# Altium project Router-UPS-9V-5V-Buck-Converter-v1.PrjPcb
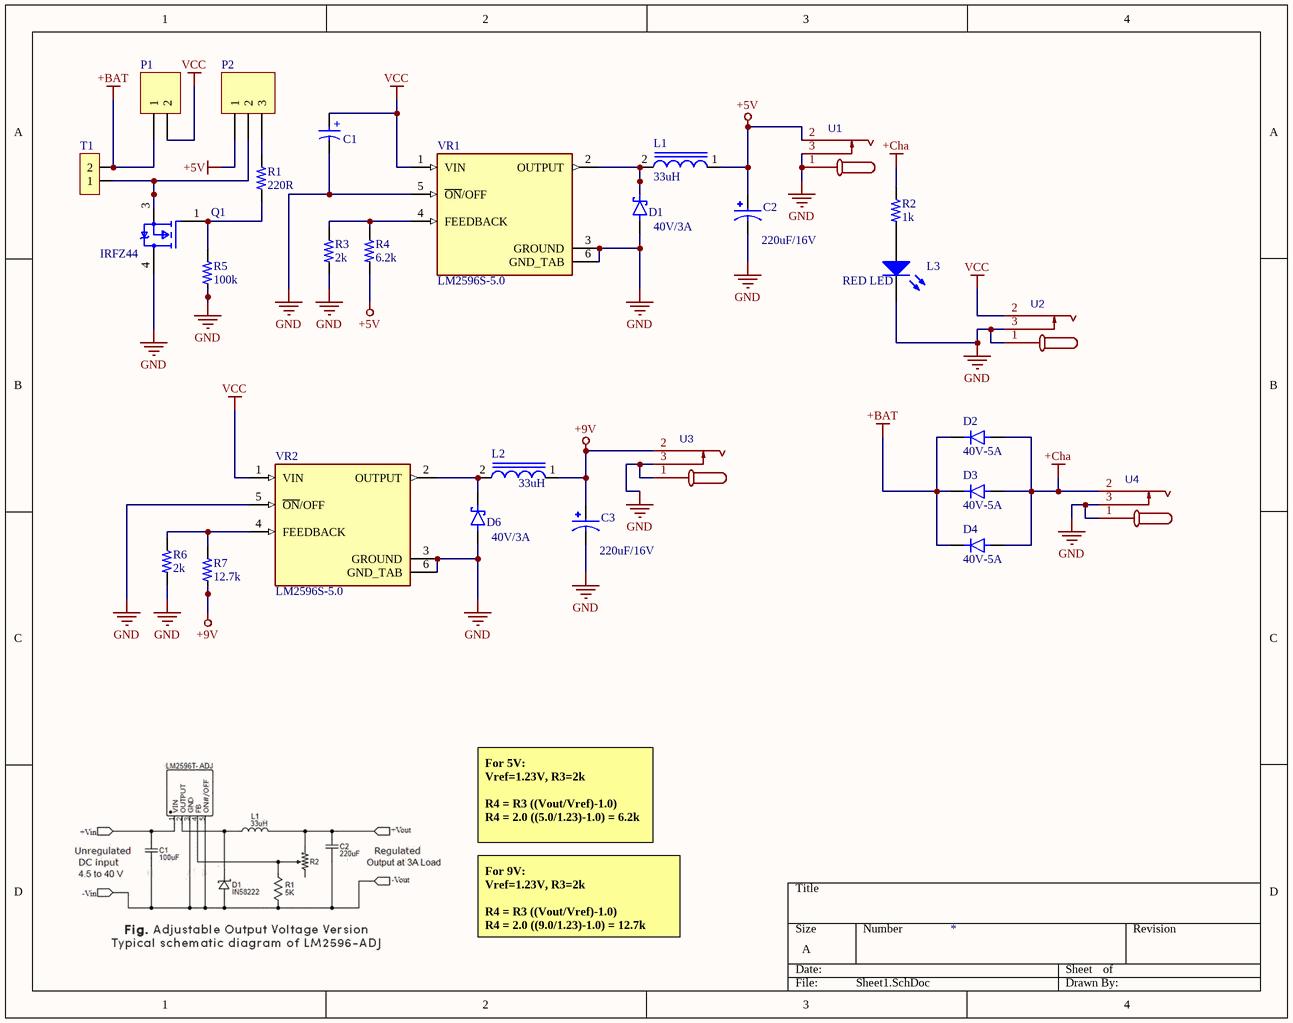
[diagram p0: Sheet1.SchDoc]
1 sheet, 28 parts. Net scope: global (net labels, ports and power ports of the same name join across sheets).
Board files: PCB1.PcbDoc, PCB-Panelize.PcbDoc

## Sheet Sheet1.SchDoc
size A; SheetNumber: 1; SheetTotal: 1

### Parts
C1  4.7µF  [WCAP-PSLP_D6.3H7.7]  (value not drawn)
C2  value 220uF/16V  [CAP-220]  (hidden comment: CAP ALUM 220uF ±20% 16V SMD)
C3  value 220uF/16V  [CAP-220]  (hidden comment: CAP ALUM 220uF ±20% 16V SMD)
D1  value 40V/3A  [SOD-123]  (hidden comment: DIODE SCHOTTKY 40V SMA(DO-214AC))
D2  value 40V-5A  [DIODE-214AC]  (hidden comment: DIODE SCHOTTKY 40V SMA)
D3  value 40V-5A  [DIODE-214AC]  (hidden comment: DIODE SCHOTTKY 40V SMA)
D4  value 40V-5A  [DIODE-214AC]  (hidden comment: DIODE SCHOTTKY 40V SMA)
D6  value 40V/3A  [SOD-123]  (hidden comment: DIODE SCHOTTKY 40V SMA(DO-214AC))
L1  value 33uH  [INDP125125X600N]  (hidden comment: FIXED IND 33uH 3A 65m SMD,12x12mm)
L2  value 33uH  [INDP125125X600N]  (hidden comment: FIXED IND 33uH 3A 65m SMD,12x12mm)
L3  value RED LED  [LED_5mm_G]  (hidden comment: LED)
P1  Header 2  [My_1X02]  (value not drawn)
P2  Header 3  [My_1X03]  (value not drawn)
Q1  value IRFZ44  [TO-263]  (hidden comment: MOSFET N-CH 60V 60A TO-263 SMD)
R1  value 220R  [RES_0805]  (hidden comment: RES 220 ±5% 125mW 0805)
R2  value 1k  [RES_0805]  (hidden comment: RES 1K 125mW 0805)
R3  value 2k  [RES_0805]  (hidden comment: RES 2K 125mW 0805)
R4  value 6.2k  [RES_0805]  (hidden comment: RES 6.2K 125mW 0805)
R5  value 100k  [RES_0805]  (hidden comment: RES 100k ±5% 125mW 0805)
R6  value 2k  [RES_0805]  (hidden comment: RES 2K 125mW 0805)
R7  value 12.7k  [RES_0805]  (hidden comment: RES 12.7K 125mW 0805)
T1  Terminal  [KF301 2Pin]  (value not drawn)
U1  DC-062A-4A-2.0  [Plugin]  (value not drawn)
U2  DC-062A-4A-2.0  [Plugin]  (value not drawn)
U3  DC-062A-4A-2.0  [Plugin]  (value not drawn)
U4  DC-062A-4A-2.0  [Plugin]  (value not drawn)
VR1  LM2596S-5.0  [TO-263-5]
VR2  LM2596S-5.0  [TO-263-5]

### Nets
+5V: C2.1 L1.1 P2.1 R4.1 U1.2
+9V: C3.1 L2.1 R7.1 U3.2
+BAT: D2.C(K) D3.C(K) D4.C(K) P1.1 T1.2
+Cha: D2.A D3.A D4.A R2.2 U4.2
GND: C1.2(N) C2.2 C3.2 D1.A D6.A L3.K Q1.4(D) R3.1 R5.1 R6.1 U1.1 U1.3 U2.1 U2.3 U3.1 U3.3 U4.1 U4.3 VR1.3(GROUND) VR1.5(~{ON}/OFF) VR1.6(GND_TAB) VR2.3(GROUND) VR2.5(~{ON}/OFF) VR2.6(GND_TAB)
VCC: C1.1(P) P1.2 U2.2 VR1.1(VIN) VR2.1(VIN)
NetD1_K: D1.K L1.2 VR1.2(OUTPUT)
NetD6_K: D6.K L2.2 VR2.2(OUTPUT)
NetL3_A: L3.A R2.1
NetP2_2: P2.2 Q1.3(S) T1.1
NetP2_3: P2.3 R1.2
NetQ1_1: Q1.1(G) R1.1 R5.2
NetR3_2: R3.2 R4.2 VR1.4(FEEDBACK)
NetR6_2: R6.2 R7.2 VR2.4(FEEDBACK)

### Notes on the sheet
- For 5V:
  Vref=1.23V, R3=2k
  R4 = R3 ((Vout/Vref)-1.0)
  R4 = 2.0 ((5.0/1.23)-1.0) = 6.2k
- For 9V:
  Vref=1.23V, R3=2k
  R4 = R3 ((Vout/Vref)-1.0)
  R4 = 2.0 ((9.0/1.23)-1.0) = 12.7k
- (in symbol CAP ALUM 470uF ±20% 16V SMD) +

### Library data of the parts
C1 = CAP ALUM 470uF ±20% 16V SMD: 470uF 16V 230mA@120Hz ±20% SMD,D6.3xL7.7mm Aluminum Electrolytic Capacitors - SMD ROHS; Manufacturer: JIERR; Mfr. Part #: JVJ16V470M6x8; Value: 470uF/16V; LCSC Part #: C46550400; Package: SMD,D6.3xL7.7mm
C2 C3 = CAP ALUM 220uF ±20% 16V SMD: 220uF 16V 110mA@120Hz ±20% SMD,D6.3xL7.7mm Aluminum Electrolytic Capacitors - SMD ROHS; Manufacturer: KNSCHA; Mfr. Part #: RVT220UF16V67RV0015; LCSC Part #: C2887273; Package: SMD,D6.3xL7.7mm; LCSC: C970695
D1 D6 = DIODE SCHOTTKY 40V SMA(DO-214AC): 40V Independent 550mV@3A 3A SMA(DO-214AC) Schottky Diodes ROHS; Manufacturer: GOODWORK; Mfr. Part #: SS34; LCSC Part #: C908680; Package: SMA(DO-214AC)
D2-D4 = DIODE SCHOTTKY 40V SMA: 40V 700mV@5A 5A SMA Schottky Diodes ROHS; Manufacturer: SMA(DO-214AC); Mfr. Part #: SS54; LCSC Part #: C22368714; Package: SMA
L1 L2 = FIXED IND 33uH 3A 65m SMD,12x12mm: 3A 33uH Magnetic Shielded Inductor ±20% SMD,12x12mm Power Inductors ROHS; Manufacturer: YJYCOIN; Mfr. Part #: YPRH1207-330M; LCSC Part #: C339951; Package: SMD,12x12mm
L3 = LED RED RED LENS TH: 20mA 300mcd Red Lens 615nm~625nm -25℃~+85℃ Red 35° 5mm Round Lens 80mW 2.4V Through Hole,D=5mm LED Indication - Discrete ROHS; Manufacturer: XINGLIGHT; Mfr. Part #: Re-released for DXP Platform.; LCSC Part #: Altium Limited; Package: Through Hole,D=5mm
P1 = Header 2: Header, 2-Pin; ASiD Part Number: Header 2-AS
P2 = Header 3: Header, 3-Pin; ASiD Part Number: Header 3-AS
Q1 = MOSFET N-CH 60V 60A TO-263 SMD: 60V 60A 12mΩ@10V,25A 87W 3V 1 N-Channel TO-263 MOSFETs ROHS; Manufacturer: Minos; Mfr. Part #: IRFZ44NS; LCSC Part #: C7587862; Package: TO-263
R1 = RES 220 ±5% 125mW 0805: 125mW Thick Film Resistor 150V ±100ppm/℃ ±5% 220Ω 0805 Chip Resistor - Surface Mount ROHS; Manufacturer: FOJAN; Mfr. Part #: FRC0805J221 TS; Package: 0805; LCSC Part #: C2933537
R2 = RES 1K 125mW 0805: 125mW Thick Film Resistor 150V ±100ppm/℃ ±5% 1kΩ 0805 Chip Resistor - Surface Mount ROHS; Manufacturer: UNI-ROYAL; Mfr. Part #: 0805W8J0102T5E; Package: 0805; LCSC Part #: C25623
R3 R6 = RES 2K 125mW 0805: 125mW Thick Film Resistor 150V ±100ppm/℃ ±1% 2kΩ 0805 Chip Resistor - Surface Mount ROHS; Manufacturer: YAGEO; Mfr. Part #: RC0805FR-072KL; Package: 0805; LCSC Part #: C114572
R4 = RES 6.2K 125mW 0805: 125mW Thick Film Resistor 150V ±100ppm/℃ ±1% 6.2kΩ 0805 Chip Resistor - Surface Mount ROHS; Manufacturer: YAGEO; Mfr. Part #: RC0805FR-076K2L; Package: 0805; LCSC Part #: C114535
R5 = RES 100k ±5% 125mW 0805: 125mW Thick Film Resistor 150V ±100ppm/℃ ±5% 100kΩ 0805 Chip Resistor - Surface Mount ROHS; Manufacturer: FOJAN; Mfr. Part #: FRC0805J104 TS; Package: 0805; LCSC Part #: C2907293
R7 = RES 12.7K 125mW 0805: 125mW Thick Film Resistor ±100ppm/℃ ±1% 12.7kΩ 0805 Chip Resistor - Surface Mount ROHS; Manufacturer: YAGEO; Mfr. Part #: RC0805FR-1312K7L; Package: 0805; LCSC Part #: C20162867
T1 = TERM BLK 2POS 5mm TH: 1x2P -30℃~+120℃ 17.5A 250V Blue 14~22 Through Hole 5mm 1.5 1 2 Through Hole,P=5mm Screw Terminal Blocks ROHS; Manufacturer: KANGNEX; Mfr. Part #: WJ301V-5.0-2P; LCSC Part #: C8475; Package: Through Hole,P=5mm; Value: *
U1-U4 = DC-062A-4A-2.0: Manufacturer: XKB Connection; Value: DC Jack; Mfr. Part #: DC-062A-4A-2.0; LCSC Part #: C5147479; Package: Through Hole,Right Angle
VR1 VR2 = LM2596S-5.0: Buck Fixed 7V~40V 5V 3A TO-263-5 DC-DC Converters ROHS; Manufacturer: UMW; Mfr. Part #: LM2596S-5.0(UMW); Value: LM2596S-5.0(UMW); LCSC Part #: C347421; Package: TO-263-5